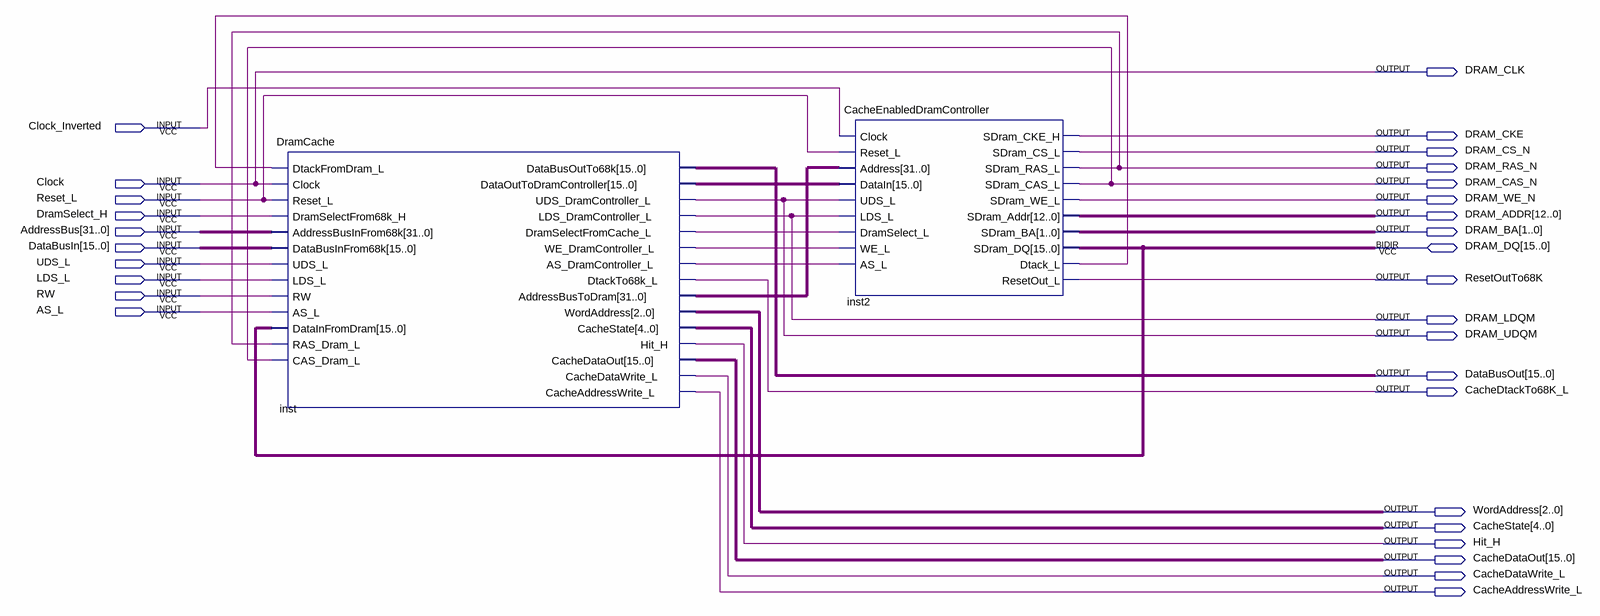
[diagram p0: schematic sheet]
// Quartus schematic CachedDramController.bdf as structural Verilog: 2 symbols, 30 pins
module CachedDramController (
  input  Clock_Inverted,
  input  Clock,
  input  Reset_L,
  input  DramSelect_H,
  input  [31:0] AddressBus,
  input  [15:0] DataBusIn,
  input  UDS_L,
  input  LDS_L,
  input  RW,
  input  AS_L,
  inout  [15:0] DRAM_DQ,
  output DRAM_CLK,
  output DRAM_CKE,
  output DRAM_CS_N,
  output DRAM_RAS_N,
  output DRAM_CAS_N,
  output DRAM_WE_N,
  output [12:0] DRAM_ADDR,
  output [1:0] DRAM_BA,
  output ResetOutTo68K,
  output DRAM_LDQM,
  output DRAM_UDQM,
  output [15:0] DataBusOut,
  output CacheDtackTo68K_L,
  output [2:0] WordAddress,
  output [4:0] CacheState,
  output Hit_H,
  output [15:0] CacheDataOut,
  output CacheDataWrite_L,
  output CacheAddressWrite_L
);

  wire inst2_dtack_l, inst_as_dramcontroller_l, inst_dramselectfromcache_l, inst_we_dramcontroller_l;
  wire [15:0] inst_dataouttodramcontroller;
  wire [31:0] inst_addressbustodram;

  DramCache inst (
    .DtackFromDram_L(inst2_dtack_l), .Clock(Clock), .Reset_L(Reset_L), .DramSelectFrom68k_H(DramSelect_H),
    .AddressBusInFrom68k(AddressBus), .DataBusInFrom68k(DataBusIn), .UDS_L(UDS_L), .LDS_L(LDS_L), .RW(RW),
    .AS_L(AS_L), .DataInFromDram(DRAM_DQ), .RAS_Dram_L(DRAM_RAS_N), .CAS_Dram_L(DRAM_CAS_N),
    .DataBusOutTo68k(DataBusOut), .DataOutToDramController(inst_dataouttodramcontroller),
    .UDS_DramController_L(DRAM_UDQM), .LDS_DramController_L(DRAM_LDQM),
    .DramSelectFromCache_L(inst_dramselectfromcache_l), .WE_DramController_L(inst_we_dramcontroller_l),
    .AS_DramController_L(inst_as_dramcontroller_l), .DtackTo68k_L(CacheDtackTo68K_L),
    .AddressBusToDram(inst_addressbustodram), .WordAddress(WordAddress), .CacheState(CacheState),
    .Hit_H(Hit_H), .CacheDataOut(CacheDataOut), .CacheDataWrite_L(CacheDataWrite_L),
    .CacheAddressWrite_L(CacheAddressWrite_L));
  CacheEnabledDramController inst2 (
    .Clock(Clock_Inverted), .Reset_L(Reset_L), .Address(inst_addressbustodram),
    .DataIn(inst_dataouttodramcontroller), .UDS_L(DRAM_UDQM), .LDS_L(DRAM_LDQM),
    .DramSelect_L(inst_dramselectfromcache_l), .WE_L(inst_we_dramcontroller_l),
    .AS_L(inst_as_dramcontroller_l), .SDram_CKE_H(DRAM_CKE), .SDram_CS_L(DRAM_CS_N),
    .SDram_RAS_L(DRAM_RAS_N), .SDram_CAS_L(DRAM_CAS_N), .SDram_WE_L(DRAM_WE_N), .SDram_Addr(DRAM_ADDR),
    .SDram_BA(DRAM_BA), .Dtack_L(inst2_dtack_l), .ResetOut_L(ResetOutTo68K), .SDram_DQ(DRAM_DQ));

  assign DRAM_CLK = Clock;
endmodule
